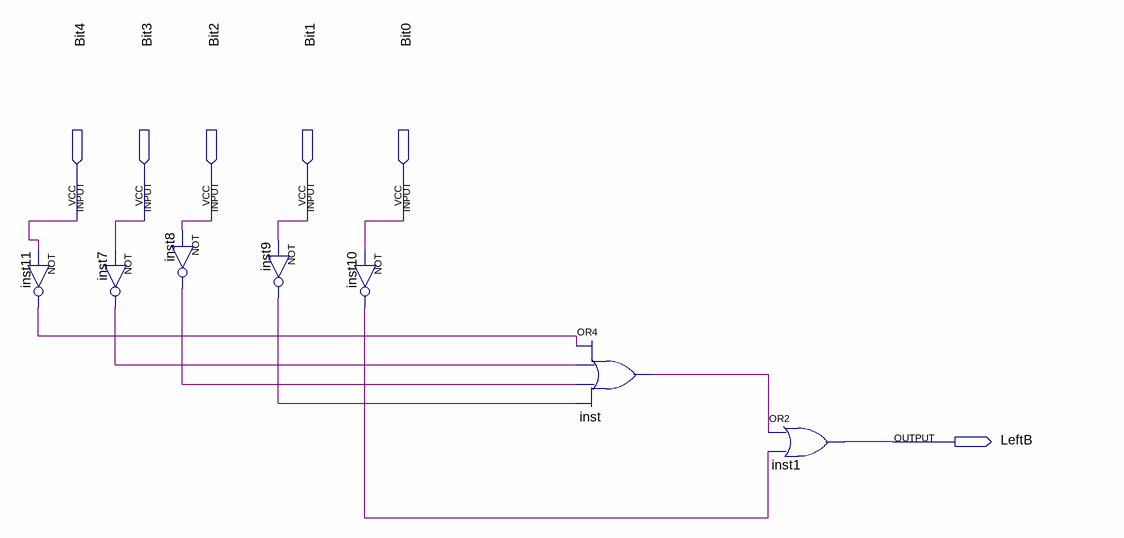
[diagram p0: schematic sheet]
// Quartus schematic LeftB.bdf as structural Verilog: 7 symbols, 6 pins
module LeftB (
  input  Bit4,
  input  Bit3,
  input  Bit2,
  input  Bit1,
  input  Bit0,
  output LeftB
);

  wire inst7_out, inst8_out, inst9_out, inst10_out, inst11_out, inst_out;

  not inst11 (inst11_out, Bit4);
  not inst7 (inst7_out, Bit3);
  not inst8 (inst8_out, Bit2);
  not inst9 (inst9_out, Bit1);
  not inst10 (inst10_out, Bit0);
  or inst (inst_out, inst11_out, inst7_out, inst8_out, inst9_out);
  or inst1 (LeftB, inst_out, inst10_out);
endmodule
